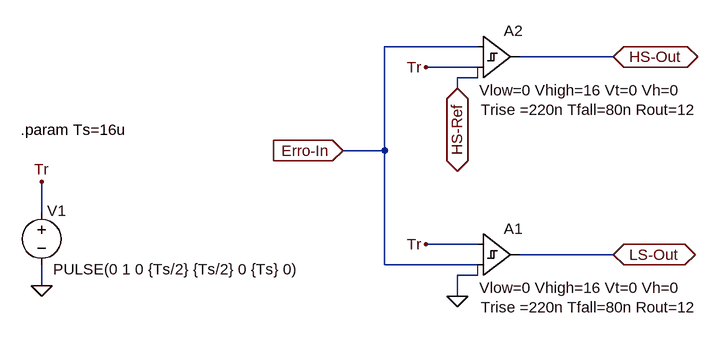
[diagram p0: schematic modulador_PWM_driver1.asc]
modulador_PWM_driver1.asc, the LTspice schematic file:
Version 4
SHEET 1 1084 680
WIRE 192 -16 48 -16
WIRE 400 0 256 0
WIRE 192 16 112 16
WIRE 192 32 160 32
WIRE 160 48 160 32
WIRE 48 144 48 -16
WIRE 48 144 -16 144
WIRE -480 240 -480 192
WIRE 192 288 112 288
WIRE 400 304 256 304
WIRE 48 320 48 144
WIRE 192 320 48 320
WIRE 192 336 160 336
WIRE -480 352 -480 320
WIRE 160 368 160 336
FLAG 400 0 HS-Out
IOPIN 400 0 BiDir
FLAG 400 304 LS-Out
IOPIN 400 304 BiDir
FLAG 160 368 0
FLAG 160 48 HS-Ref
IOPIN 160 48 BiDir
FLAG -16 144 Erro-In
IOPIN -16 144 In
FLAG -480 352 0
FLAG -480 192 Tr
FLAG 112 16 Tr
FLAG 112 288 Tr
SYMBOL Digital\\diffschmtbuf 192 -64 R0
WINDOW 3 2 115 Left 2
WINDOW 123 4 145 Left 2
SYMATTR Value Vlow=0 Vhigh=16 Vt=0 Vh=0
SYMATTR Value2 Trise =220n Tfall=80n Rout=12
SYMATTR InstName A2
SYMBOL voltage -480 224 R0
WINDOW 3 18 103 Left 2
WINDOW 123 0 0 Left 2
WINDOW 0 9 13 Left 2
SYMATTR Value PULSE(0 1 0 {Ts/2} {Ts/2} 0 {Ts} 0)
SYMATTR InstName V1
SYMATTR SpiceLine Rser=0
SYMBOL Digital\\diffschmtbuf 192 240 R0
WINDOW 3 2 115 Left 2
WINDOW 123 4 145 Left 2
SYMATTR Value Vlow=0 Vhigh=16 Vt=0 Vh=0
SYMATTR Value2 Trise =220n Tfall=80n Rout=12
SYMATTR InstName A1
TEXT -512 112 Left 2 !.param Ts=16u

The netlist it stands for:
* modulador_PWM_driver1.asc
A2 Erro-In Tr HS-Ref HS-Ref HS-Ref HS-Ref HS-Out HS-Ref SCHMITT Vlow=0 Vhigh=16 Vt=0 Vh=0 Trise =220n Tfall=80n Rout=12
V1 Tr 0 PULSE(0 1 0 {Ts/2} {Ts/2} 0 {Ts} 0) Rser=0
A1 Tr Erro-In 0 0 0 0 LS-Out 0 SCHMITT Vlow=0 Vhigh=16 Vt=0 Vh=0 Trise =220n Tfall=80n Rout=12
.param Ts=16u
.backanno
.end